# Altium schematic sheet Pedestal.SchDoc
size A4
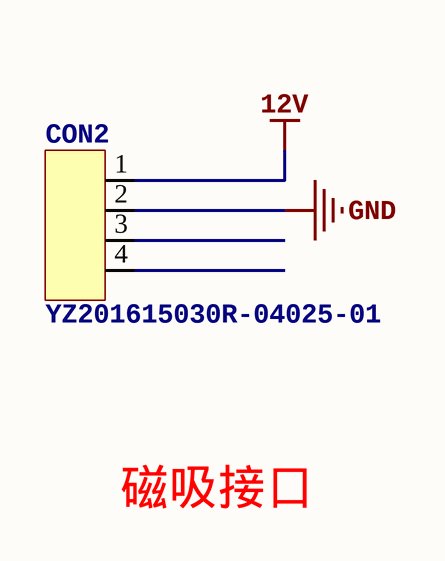
[diagram p0: Pedestal.SchDoc]

## Parts
CON2  YZ201615030R-04025-01

## Nets
12V: CON2.1
GND: CON2.2

Not connected (* = marked no-connect by the designer): CON2 3 4

## Notes on the sheet
- 磁吸接口

## Library data of the parts
CON2 = YZ201615030R-04025-01: 磁吸连接器